# Altium schematic sheet LiPo_Charger.SchDoc: Shipwars Charger Shematic
size 431 x 279 mm; CheckedBy: SP, PS; Author: SP, PS; CompanyName: UPenn; DrawnBy: SP, PS; Engineer: SP, PS; Organization: UPenn; Address1: 200 S 33rd Street; Address2: Detkin Lab; Address3: Philadelphia; Address4: PA 19104; Revision: .1.0.0; SheetNumber: 5; SheetTotal: 10; Project: Shipwars
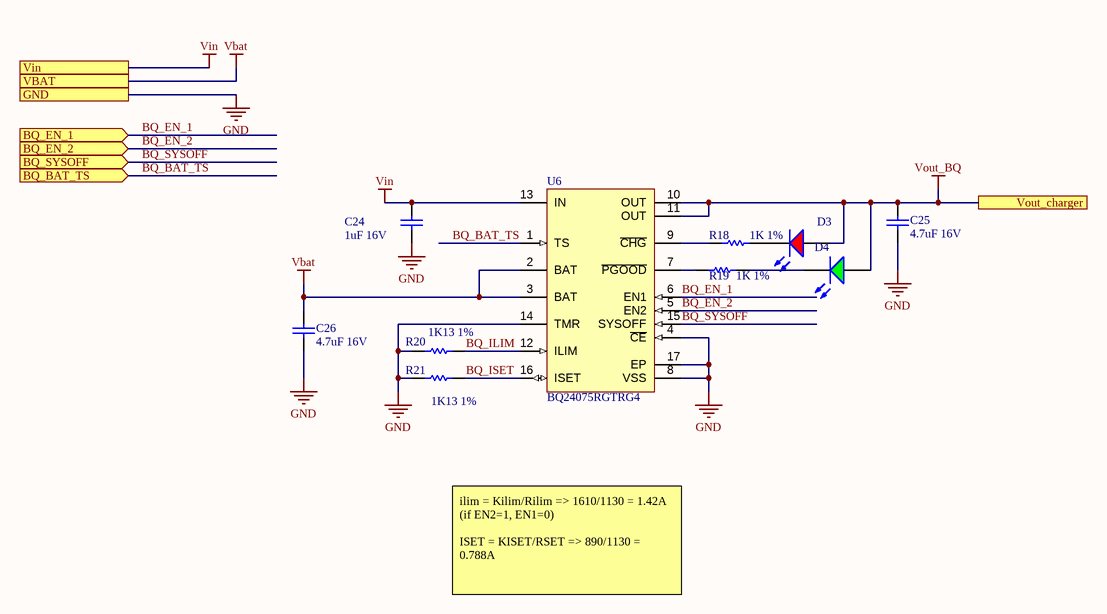
[diagram p0: LiPo_Charger.SchDoc]

## Parts
C24  1uF 16V  [CAPC0603(1608)100_N]
C25  4.7uF 16V  [CAPC0805(2012)145_N]
C26  4.7uF 16V  [CAPC0805(2012)145_N]
D3  LTST-C170CKT  [LTST-C170CKT_V]  (value not drawn)
D4  LTST-C170GKT  [LTST-C170GKT_V]  (value not drawn)
R18  1K 1%  [RESC0603(1608)_N]
R19  1K 1%  [RESC0603(1608)_N]
R20  1K13 1%  [RESC0603(1608)_N]
R21  1K13 1%  [RESC0603(1608)_N]
U6  BQ24075RGTRG4  [RGT16-1700X1700TP]

## Ports
BQ_BAT_TS (in), BQ_EN_1 (in), BQ_EN_2 (in), BQ_SYSOFF (in), GND, VBAT, Vin, Vout_charger

## Nets
GND: C24.1 C25.1 C26.2 R20.1 R21.1 U6.4(~{CE}) U6.8(VSS) U6.14(TMR) U6.17(EP) ; port GND
Vbat: C26.1 U6.2(BAT) U6.3(BAT) ; port VBAT
Vin: C24.2 U6.13(IN) ; port Vin
Vout_BQ: C25.2 D3.1(A) D4.1(A) U6.10(OUT) U6.11(OUT) ; port Vout_charger
BQ_BAT_TS: U6.1(TS) ; port BQ_BAT_TS
BQ_EN_1: U6.6(EN1) ; port BQ_EN_1
BQ_EN_2: U6.5(EN2) ; port BQ_EN_2
BQ_ILIM: R20.2 U6.12(ILIM)
BQ_ISET: R21.2 U6.16(ISET)
BQ_SYSOFF: U6.15(SYSOFF) ; port BQ_SYSOFF
NetD3_2: D3.2(K) R18.2
NetD4_2: D4.2(K) R19.2
NetR18_1: R18.1 U6.9(~{CHG})
NetR19_1: R19.1 U6.7(~{PGOOD})

## Notes on the sheet
- ilim = Kilim/Rilim => 1610/1130 = 1.42A (if EN2=1, EN1=0)
  ISET = KISET/RSET => 890/1130 = 0.788A
- DWG. NO.
- REV.
- SHT.
- THIS DOCUMENT AND THE DATA DISCLOSED HEREIN OR HEREWITH IS THE PROPERTY OF ALTIUM LIMITED AND MAY BE FREELY DISTRIBUTED IN WHOLE. NO RIGHTS ARE RESERVED OR EXPRESS OR IMPLIED WARANTEE GIVEN.
- REVISION
- DESCRIPTION
- DATE
- APPROVED
- ENG:
- APPROVALS
- PROJECT
- DSN:
- CHK:
- REFERENCE DOCUMENTS
- PROJECT REVISION:
- TITLE
- DOCUMENT REVISION:
- DESIGN ITEM:
- BOM:
- FAB DWG:
- PCB DWG:
- ASSY DWG:
- SCALE:
- SIZE
- B
- CAGE CODE
- FILE NAME
- DWG NO.
- SHEET
- OF
- REV

## Library data of the parts
C24 = CMP-1035-02736-1: CAP 1uF 16V ±5% 0603 (1608 Metric) Thickness 1mm SMD; Case-Metric: 1608; Case-EIA: 0603; Tolerance: Â±5%; Technology: SMT; Max Thickness: 1 mm; Rated Voltage: 16 V; Value: 1uF
C25 C26 = CMP-1036-04893-1: CAP 4.7uF 16V -20% to +80% 0805 (2012 Metric) Thickness 1.45mm SMD; Case-Metric: 2012; Case-EIA: 0805; Max Thickness: 1.45 mm; Value: 4.7uF; Rated Voltage: 16 V; Tolerance: -20% to +80%; Technology: SMT
D3 = CMP-1674-00001-5: LED Uni-Color Red, 100 mW, 200 mA, -55 to 85 degC, 2-Pin SMD, RoHS, Tape and Reel; Manufacturer: Lite-On; PackageReference: C170CKT; ComponentLink1Description: Manufacturer URL; ComponentLink1URL: http://www.us.liteon.com/; Package Quantity: 3000; Packaging: Tape and Reel; Pins: 2; ComponentLink2URL: http://media.digikey.com/pdf/Data%20Sheets/Lite-On%20PDFs/LTST-C170CKT.pdf; Max Operating Temperature: 85 degC; Min Operating Temperature: -55 degC; Mounting Technology: Surface Mount; Mount: Surface Mount; Length: 2 mm; ComponentLink2Description: Datasheet; DatasheetVersion: 03/2003; Height: 1.1 mm; PackageDescription: 2-Pin Surface Mount Device, Body 2 x 1.25 mm; RoHSCompliant: true; Colour: Red
D4 = CMP-1674-00002-5: LED Uni-Color Green, 100 mW, 120 mA, -55 to 85 degC, 2-Pin SMD, RoHS, Tape and Reel; Manufacturer: Lite-On; PackageReference: C170GKT; ComponentLink1Description: Manufacturer URL; ComponentLink1URL: http://www.us.liteon.com/; Height: 1.1 mm; PackageDescription: 2-Pin Surface Mount Device, Body 2 x 1.25 mm; RoHSCompliant: true; Package Quantity: 1; Packaging: Tape and Reel; Mount: Surface Mount; Min Operating Temperature: -55 degC; DatasheetVersion: 03/2003; Max Operating Temperature: 85 degC; Pins: 2; Mounting Technology: Surface Mount; Length: 2 mm; Colour: Green; ComponentLink2URL: http://media.digikey.com/pdf/Data%20Sheets/Lite-On%20PDFs/LTST-C170GKT.pdf; ComponentLink2Description: Datasheet
R18 R19 = CMP-1012-00510-1: 1K 0.1W 1% 0603 (1608 Metric)  SMD; Case-Metric: 1608; Case-EIA: 0603; Value: 1000.00 Ohm; Technology: SMT; Tolerance: 1 %; Power: 0.1 W
R20 R21 = CMP-1012-00515-1: 1K13 0.1W 1% 0603 (1608 Metric)  SMD; Value: 1130.00 Ohm; Case-EIA: 0603; Case-Metric: 1608; Power: 0.1 W; Tolerance: 1 %; Technology: SMT
U6 = CMP-0321-00237-1: USB-Friendly Li-Ion Battery Charger and Power-Path Management IC, Vout 5.5 V, 4.3 V, -40 to 85 degC, 16-pin QFN (RGT), Green (RoHS & no Sb/Br); Manufacturer: Texas Instruments; Li-Ion: N; SubFamily: Battery Charge Management; Vin(Min)(V): 4.3; ComponentLink1URL: http://www.ti.com/general/docs/lit/getliterature.tsp?genericPartNumber=BQ24075&fileType=pdf; Over Voltage Protection: N; PackageDescription: 16-Pin Plastic Quad Flat No-Lead, 3 x 3 mm Body, 0.5 mm Pitch, 1.7 x 1.7 mm Exposed Pad; NiMH: N; Li-Polymer: N; Eco-Plan: Green (RoHS & no Sb/Br); Code_JEDEC: MO-220; Lead Acid: N; PartNumber: BQ24075RGTRG4; ComponentLink1Description: Datasheet; Mounting Technology: Surface Mount; PackageVersion: revH, Oct-2011; PackageReference: RGT16-1700X1700TP; NiCd: N; DatasheetVersion: SLUS810G